# EAGLE design candle_circuit (EAGLE 7.3.0)
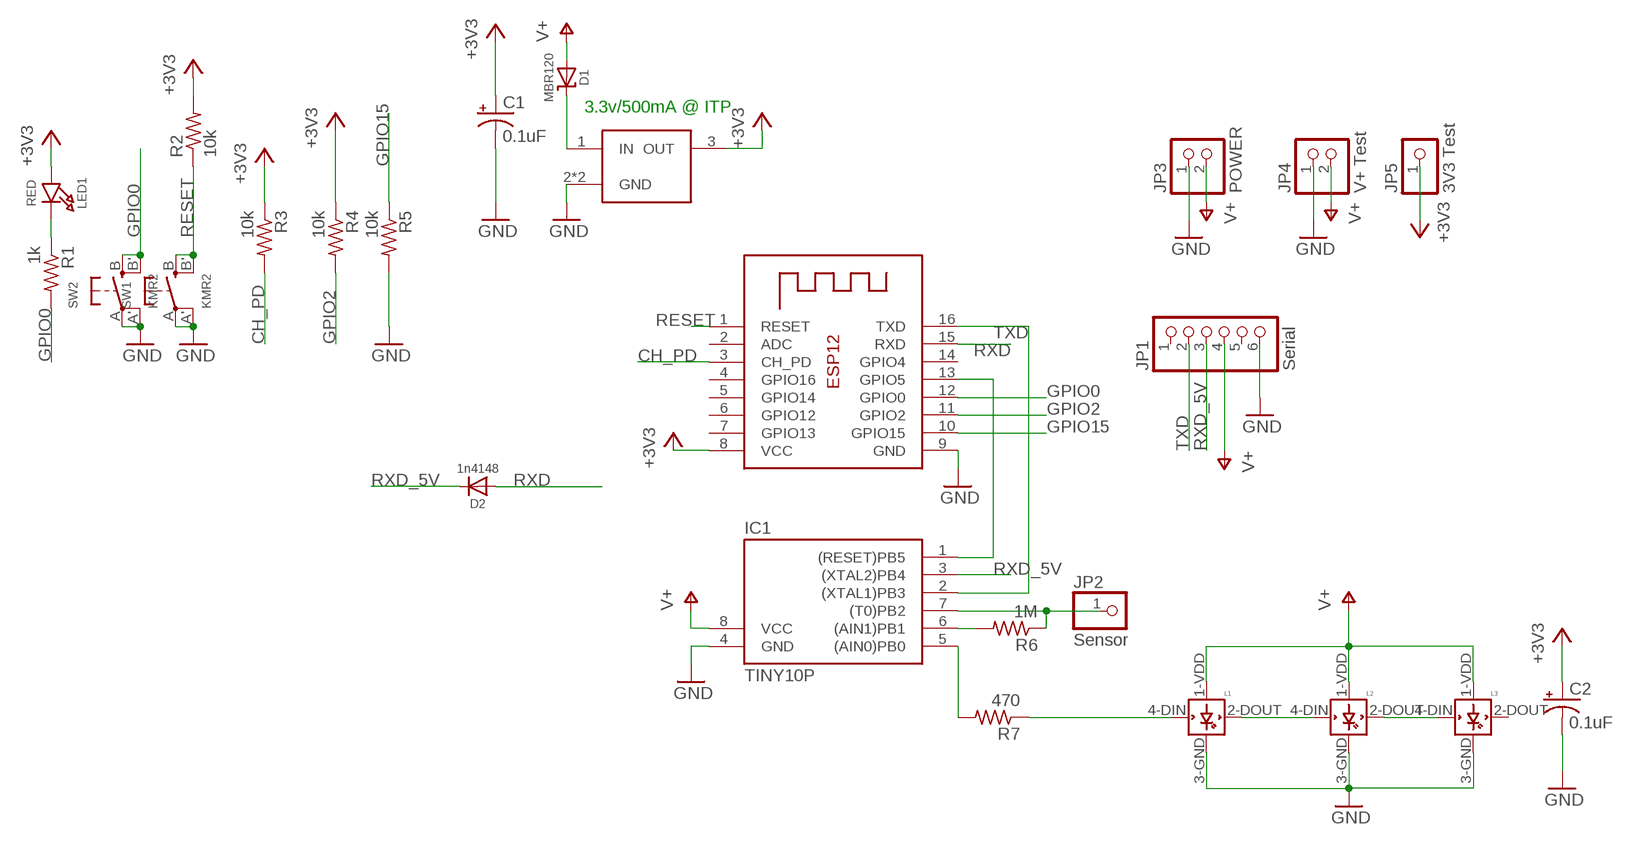
[diagram p0: schematic, sheet 1]

## Parts
C1  0.1uF  CAP_POLC  [PANASONIC_C]
C2  0.1uF  CAP_POLC  [PANASONIC_C]
D1  MBR120  DIODE-SCHOTTKYSOD-123  [SOD-123]
D2  1n4148  DIODESOD-323  [SOD-323]
IC1  TINY10P  [DIL08]
IC2  ESP-12  [ESP-12]
JP1  Serial  HEADER-1X6  [1X06_OVAL]
JP2  Sensor  PINHD-1X1  [1X01]
JP3  POWER  HEADER-1X2  [1X02_OVAL]
JP4  V+ Test  HEADER-1X2  [1X02_OVAL]
JP5  3V3 Test  PINHD-1X1  [1X01]
L1  WS2812B  [WS2812B]
L2  WS2812B  [WS2812B]
L3  WS2812B  [WS2812B]
LED1  RED  LED0805_NOOUTLINE  [CHIPLED_0805_NOOUTLINE]
R1  1k  R-US_R0603  [R0603]
R2  10k  R-US_R0603  [R0603]
R3  10k  R-US_R0603  [R0603]
R4  10k  R-US_R0603  [R0603]
R5  10k  R-US_R0603  [R0603]
R6  1M  R-US_R0603  [R0603]
R7  470  R-US_R0603  [R0603]
SW1  KMR2  SWITCH_TACT_SMT4.6X2.8  [BTN_KMR2_4.6X2.8]
SW2  KMR2  SWITCH_TACT_SMT4.6X2.8  [BTN_KMR2_4.6X2.8]
U1  REGULATOR3.3V-UA78M33CDCYR  [SOT223]

## Nets
+3V3: C1.+ C2.+ IC2.8(VCC) JP5.1 LED1.A R2.2 R3.1 R4.1 U1.3(OUT)
CH_PD: IC2.3(CH_PD) R3.2
GND: C1.- C2.- IC1.4(GND) IC2.9(GND) JP1.6 JP3.1 JP4.1 L1.3-GND(GND) L2.3-GND(GND) L3.3-GND(GND) R5.2 SW1.A'(P1) SW1.A(P) SW2.A'(P1) SW2.A(P) U1.2(GND) U1.4(GND)
GPIO0: IC2.12(GPIO0) R1.2 SW2.B'(S1) SW2.B(S)
GPIO2: IC2.11(GPIO2) R4.2
GPIO15: IC2.10(GPIO15) R5.1
N$1: IC1.5((AIN0)PB0) R7.2
N$2: L1.2-DOUT(DOUT) L2.4-DIN(DIN)
N$3: L2.2-DOUT(DOUT) L3.4-DIN(DIN)
N$4: IC1.1((RESET)PB5) IC2.13(GPIO5)
N$5: D1.C U1.1(IN)
N$6: LED1.C R1.1
N$7: IC1.6((AIN1)PB1) R6.2
N$8: L1.4-DIN(DIN) R7.1
RESET: IC2.1(RESET) R2.1 SW1.B'(S1) SW1.B(S)
RXD: D2.A IC2.15(RXD)
RXD_5V: D2.C IC1.3((XTAL2)PB4) JP1.3
SENSOR: IC1.7((T0)PB2) JP2.1 R6.1
TXD: IC1.2((XTAL1)PB3) IC2.16(TXD) JP1.2
V+: D1.A IC1.8(VCC) JP1.4 JP3.2 JP4.2 L1.1-VDD(VDD) L2.1-VDD(VDD) L3.1-VDD(VDD)
Unconnected: IC2.2(ADC) IC2.4(GPIO16) IC2.5(GPIO14) IC2.6(GPIO12) IC2.7(GPIO13) IC2.14(GPIO4) JP1.1 JP1.5 L3.2-DOUT(DOUT)

## Notes on the sheet
- 3.3v/500mA @ ITP

## Library data of the parts
C1 C2 = SparkFun-Capacitors:CAP_POL: Capacitor Polarized These are standard SMD and PTH capacitors. Normally 10uF, 47uF, and 100uF in electrolytic and tantalum varieties. Always verify the external diameter of the through hole cap, it varies with capacity, voltage, and manufacturer. The EIA devices should be standard.
D1 = microbuilder:DIODE-SCHOTTKY
D2 = microbuilder:DIODE: Diode SMA Model Volts Amps Type Vf Ir Digikey # Notes SSA34-E3 40V 3A Schottky 480mV @ 3A 200uA @ 40V SSA34-E3/61TGITR-ND CDBA120-G 20V 1A Schottky 500mV @ 1A 500uA @ 20V 641-1014-6-ND REEL MBRA210 10V 2A Schottky 350mV @ 2A 700uA @ 10V MBRA210LT3 SOD-123 Model Volts Amps Type Vf Ir Order # Notes BAT54T1G 30V 200mA Schottky 800mV @ 200mA 2uA @ 25V BAT54T1GOSTR-ND B0530W 30V 500mA Schottky 430mV @ 500mA 130uA @ 30V B0530W-FDICT-ND REEL MBR120 20V 1A Schottky 340mV @ 1A MBR120VLSFT1GOSCT-ND SOD-323 Model Volts Amps Type Vf Ir Order # Notes PMEG2005EJ 20V 500mA Schottky 355mV @ 500mA 568-4110-1-ND ZLLS410 10V 570mA Schottky 380mV @ 570mA ZLLS410CT-ND 1N4148WS 75V 150mA Silicon/Simple 1V 1N4148WSFSCT-ND REEL SOD-523 Model Volts Amps Type Vf Ir Order # Notes BAT54XV2 30V 200mA Schottky 0.8V @ 100mA BAT54XV2CT-ND TB751S 30V 30mA Schottky RB751S-40TE61CT-ND SOT23-R/W (R = Solder Paste/Reflow Ovens, W = Hand-Soldering) Model Volts Amps Type Vf Ir Order # Notes BAT54FILM 40V 300mA Schottky 497-7162-1-ND POWERDI-5 Model Volts Amps Type Vf Ir Order # Notes PDS560 60V 5A Schottky 670mV @ 5A 150uA @ 60V PDS560DICT-ND
IC1 = atmel:TINY10: MICROCONTROLLER 1 Kbytes ROM; OC_FARNELL: unknown; OC_NEWARK: unknown
IC2 = adafruit:ESP-12
JP1 = microbuilder:HEADER-1X6: PIN HEADER
JP2 JP5 = pinhead:PINHD-1X1: PIN HEADER
JP3 JP4 = microbuilder:HEADER-1X2: PIN HEADER
L1-L3 = adafruit:WS2812B
LED1 = microbuilder:LED: LED 0603 - 0603 Surface Mount Package 2mA: Green LED - Low Power (3.9mcd, 2ma, 1.7Vf) - Digikey: 475-2709-2-ND Orange LED - Low Power (9.8mcd, 2ma, 1.8Vf) - Digikey: 475-1194-2-ND Red LED - Low Power (5mcd, 2ma, 1.8Vf) - Digikey: 475-1195-2-ND Yellow LED - Low Power (7mcd, 2ma, 1.8Vf) - Digikey: 475-1196-2-ND 5mA: Blue LED - Low Power (17mcd, 5ma, 2.9Vf) - Digikey: LNJ937W8CRACT-ND 0805 - 0805 Surface Mount Package 2mA: Red LED (8.8mcd, 2mA, 1.8Vf, Clear) - Low Power [Digikey: 475-2510-1-ND] Green LED (5mcd, 2mA, 1.8Vf, Clear) - Low Power [Digikey: 475-2730-1-ND] Yellow LED (11.3mcd, 2mA, 1.8Vf, Clear) - Low Power [Digikey: 475-2555-1-ND] 20mA: Red LED (104mcd, 20mA, Diffused) - LS R976 [Digikey: 475-1278-6-ND] Red LED (12mcd, 20mA, 2.0Vf, Clear) - APT2012EC [Digikey: 754-1128-1-ND] Green LED (15mcd, 20mA, 2.2Vf, Clear) - APT2012GC [Digikey: 754-1131-1-ND] Orange LED (160mcd, 20mA, 2.1Vf, Clear) - APT2012SECK [Digikey: 754-1130-1-ND] 1206 - 1206 Surface Mount Package Green LED (26mcd, 20mA, Diffused) - LG N971 [Digikey: 475-1407-6-ND] Red LED (15mcd, 20mA, Diffused) - LH N974 [Digikey: 475-1416-6-ND] Cree - Cree High-Power Surface Mount LEDs XPEBWT-L1-0000-00D50 - White 111lm 350mA 2.9Vf 6200K 110° XTEAWT-00-0000-00000LEE3 - White 114lm 350mA 2.85Vf 5000K 115° Everlight - Everlight 45-21 Series Surface Mount LEDs 45-21/QK2C-B2832AC2CB2/2T - Warm White 2000mcd 20mA 3.25Vf 3050K 120° 45-21/LK2C-B38452C4CB2/2T - Nuetral White 2000mcd 20mA 3.25Vf 4150K 120° 45-21/LK2C-B50634C6CB2/2T - Cold White 2200mcd 20mA 3.25Vf 5650K 120° PLCC2 Reverse Mount LS T77K-J1L2-1-0-2-R18-Z - Red 11.25mcd 2mA 1.8Vf 630nm 120° LO T77K-L1M2-24-Z - Orange 19.6mcd 2mA 1.8Vf 606nm 120° LY T77K-K2M1-26-Z - Yellow 15.7mcd 2mA 1.8Vf 587nm 120°
R1-R7 = adafruit:R-US_: RESISTOR, American symbol
SW1 SW2 = microbuilder:SWITCH_TACT_SMT: SMT Tact Switches 6x6mm - Digikey: P12940SCT-ND KMR2 (4.6x2.8mm) - Digikey: 401-1426-1-ND EVQ-PQHB55 - Light Touch, 160GF (4.5x4.5mm) - Digikey: P8090SCT-ND KMT0 - KMT021 NGJ LHS (etc.) IP68/Waterproof - Digikey: CKN10289CT-ND
U1 = ITP_Lab:REGULATOR

## Board
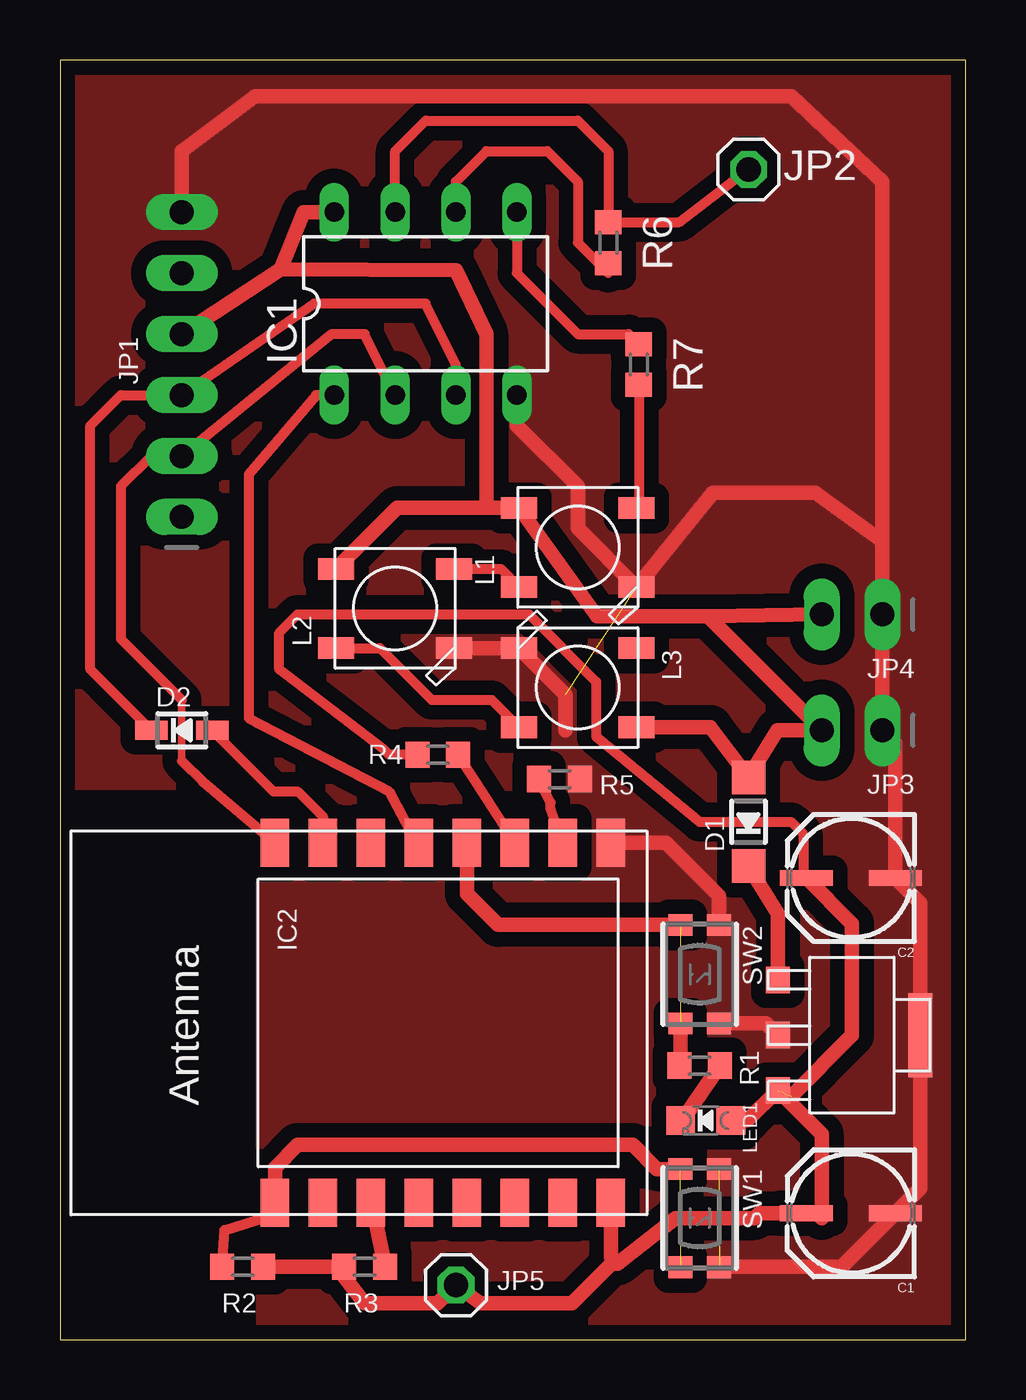
[diagram p1: board, top side]

Size 37.77 x 53.33 mm. Coordinates in mm from the lower left corner, seen from the top.
Outline: 0,0 37.77,0 37.77,53.33 0,53.33 0,0
Copper layers (1*16): Top 0.0356mm / dielectric 1.5011mm / Bottom 0.0356mm
Design rules "oshpark *": minimum track width 8mil, minimum drill 15mil, track to track 8mil, track to pad 8mil, pad to pad 8mil, via to via 8mil, smd to smd 8mil, copper to edge 15mil, drill to drill 0.3mm, minimum pad ring 7mil, minimum via ring 7mil, stop-mask expansion 3mil, vias tented up to drill 0mil, thermal gap 10mil

### Footprints (pad centres in the part's own frame; a part is rotated, then mirrored left to right if it is on the bottom)
PANASONIC_C = smd 2.2 x 0.65: + 1.9,-0.2; - -1.8,-0.2
SOD-123 = smd 1.4 x 1.4: A 1.85,0; C -1.85,0
SOD-323 = smd 1.35 x 0.8: A 1.27,0; C -1.27,0
DIL08 = drill 0.813 long: 1 -3.81,-3.81; 2 -1.27,-3.81; 3 1.27,-3.81; 4 3.81,-3.81; 5 3.81,3.81; 6 1.27,3.81; 7 -1.27,3.81; 8 -3.81,3.81
ESP-12 = smd 2 x 1.2: 1 -7.5,4.5; 2 -7.5,2.5; 3 -7.5,0.5; 4 -7.5,-1.5; 5 -7.5,-3.5; 6 -7.5,-5.5; 7 -7.5,-7.5; 8 -7.5,-9.5; 9 7.5,-9.5; 10 7.5,-7.5; 11 7.5,-5.5; 12 7.5,-3.5; 13 7.5,-1.5; 14 7.5,0.5; 15 7.5,2.5; 16 7.5,4.5
1X06_OVAL = drill 1 long: 1 -6.35,0; 2 -3.81,0; 3 -1.27,0; 4 1.27,0; 5 3.81,0; 6 6.35,0
1X01 = drill 1.016 octagon: 1 0,0
1X02_OVAL = drill 1 long: 1 -1.27,0; 2 1.27,0
WS2812B = smd 1.5 x 0.9: 1-VDD 2.45,-1.65; 2-DOUT 2.45,1.65; 3-GND -2.45,1.65; 4-DIN -2.45,-1.65
CHIPLED_0805_NOOUTLINE = smd 1.2 x 1.2: A 0,-1.05; C 0,1.05
R0603 = smd 1 x 1.1: 1 -0.85,0; 2 0.85,0
BTN_KMR2_4.6X2.8 = smd 0.9 x 1: A 2.05,0.8; A' -2.05,0.8; B 2.05,-0.8; B' -2.05,-0.8
SOT223 = smd 1.1 x 1: 1 -2.3,-3.1; 2 0,-3.1; 3 2.3,-3.1 | smd 3.5 x 1: 4 0,2.85

### Placement (x,y rotation side)
C1  33.02,5.08 180 top
C2  33.02,19.05 180 top
D1  28.7,21.59 90 top
D2  5.08,25.4 0 top
IC1  15.24,43.18 0 top
IC2  13.46,13.21 90 top
JP1  5.08,40.64 90 top
JP2  28.7,48.77 0 top
JP3  33.02,25.4 180 top
JP4  33.02,30.23 180 top
JP5  16.51,2.29 0 top
L1  21.59,33.02 180 top
L2  13.97,30.48 180 top
L3  21.59,27.18 0 top
LED1  26.92,9.14 90 top
R1  26.67,11.43 180 top
R2  7.62,3.05 0 top
R3  12.7,3.05 0 top
R4  15.75,24.38 0 top
R5  20.83,23.37 0 top
R6  22.86,45.72 270 top
R7  24.13,40.64 90 top
SW1  26.67,5.08 270 top
SW2  26.67,15.24 270 top
U1  33.02,12.7 270 top

### Tracks (layer width: path | path; a pad name or v marks a point on that pad's centre or on a via)
+3V3  (1 unrouted)
  Top 0.406: C1.+ 30.71,5.28 | C2.+ 30.99,19.38 30.99,21.08 30.48,21.59 26.67,21.59 22.35,25.15 22.35,27.43 19.56,30.23 9.91,30.23 9.14,29.46 9.14,27.94 13.46,24.64 13.72,24.38 R4.1
  Top 0.61: C2.+ 33.02,17.35 33.02,12.7 30.48,10.16 | R2.2 R3.1 11.85,2.63 12.7,1.52 15.75,1.52 JP5.1 17.53,1.52 21.34,1.52 22.99,3.17 23.24,3.17 | LED1.A 28.66,9.14 U1.3 31.75,8.57 31.75,5.08 31.55,5.28 C1.+ 29.16,5.28 28.96,5.08 25.65,5.08 23.24,3.17 | IC2.8 22.96,3.45 23.24,3.17
CH_PD
  Top 0.61: IC2.3 13.14,5.07 R3.2
GND  (2 unrouted)
  Top 0.406: IC2.9 22.61,21.06 22.79,21.25 | 21.08,25.4 21.08,25.33
  Top 0.61: L2.3-GND L3.3-GND 21.08,26.89 21.08,25.4 | JP1.6 5.08,49.53 8.13,51.82 30.48,51.82 34.29,48.26 34.29,33.27 | 34.29,33.27 31.5,35.31 27.21,35.31 L1.3-GND 21.59,33.82 21.59,35.56 19.05,38.1 IC1.4 | 34.29,33.27 JP3.1 34.82,24.87 C2.- 35.87,18.2 U1.4 35.87,6.33 C1.- 32.59,3.05 27.49,3.05 SW1.A | SW2.A 29.43,13.19 U1.2 | IC2.9 25.27,20.71 27.47,18.5 SW2.A'
  pour Top (isolate 0.61, no thermals): 0.51,52.58 37.08,52.58 37.08,0.51 8.38,0.51 8.38,23.11 0.51,23.11
GPIO0  (1 unrouted)
  Top 0.61: SW2.B' 18.27,17.29 16.96,18.6 IC2.12 | SW2.B 25.87,11.48 R1.2
GPIO2
  Top 0.406: IC2.11 19.05,20.8 19.05,21.34 18.54,21.34 | 19.05,20.62 IC2.11 | 18.73,20.94 IC2.11 | R4.2 IC2.11
GPIO15
  Top 0.406: 20.99,20.74 IC2.10 20.45,22.1 20.45,22.38 R5.1
N$1
  Top 0.406: IC1.5 19.05,44.45 21.59,41.91 23.71,41.91 R7.2
N$2
  Top 0.406: L2.4-DIN 18.38,32.13 L1.2-DOUT
N$3
  Top 0.406: L2.2-DOUT 13.33,28.83 15.49,26.67 18,26.67 L3.4-DIN
N$4
  Top 0.406: IC1.1 10.67,39.37 7.87,36.07 7.87,25.91 13.72,22.86 14.73,20.94 IC2.13
N$5
  Top 0.61: D1.C 29.92,17.76 U1.1
N$6
  Top 0.61: LED1.C 26.07,9.34 R1.1
N$7
  Top 0.406: IC1.6 16.51,48.26 17.78,49.53 20.32,49.53 21.59,48.26 21.59,45.72 22.86,44.45 R6.2
N$8
  Top 0.406: R7.1 24.13,34.76 L1.4-DIN
RESET  (1 unrouted)
  Top 0.406: R2.1 6.86,4.57 8.96,5.24
  Top 0.61: 8.96,5.24 IC2.1 8.96,7.18 9.91,8.13 23.88,8.13 24.89,7.11 25.85,7.11 SW1.B'
RXD
  Top 0.406: D2.A 8.89,22.86 9.91,22.86 10.96,21.8 IC2.15
RXD_5V
  Top 0.406: D2.C 1.27,27.94 1.27,38.1 2.54,39.37 JP1.3 10.59,43.18 15.24,43.18 16.51,40.64 IC1.3
SENSOR
  Top 0.406: IC1.7 13.97,49.53 15.24,50.8 21.59,50.8 22.86,49.53 R6.1 25.82,46.57 JP2.1
TXD
  Top 0.305: 5.08,26.67 5.08,24.13
  Top 0.406: 5.08,26.67 2.54,29.21 2.54,35.56 3.81,36.83 JP1.2 11.33,41.91 12.7,41.91 IC1.2 | 5.08,24.13 5.96,23.25 IC2.16
V+
  Top 0.61: L2.1-VDD 14.06,34.67 17.78,34.67 | 17.78,34.67 L1.1-VDD 22.39,30.15 27,30.15 | L3.1-VDD 27.12,25.53 D1.A 29.9,25.4 JP3.2 27,30.15 | 9.2,44.6 10.16,46.99 IC1.8 | JP1.4 9.2,44.6 | 9.2,44.6 16.51,44.58 17.78,41.91 17.78,34.67 | 27,30.15 JP4.2